# EAGLE design dc5032018banglet (EAGLE 8.6.3)
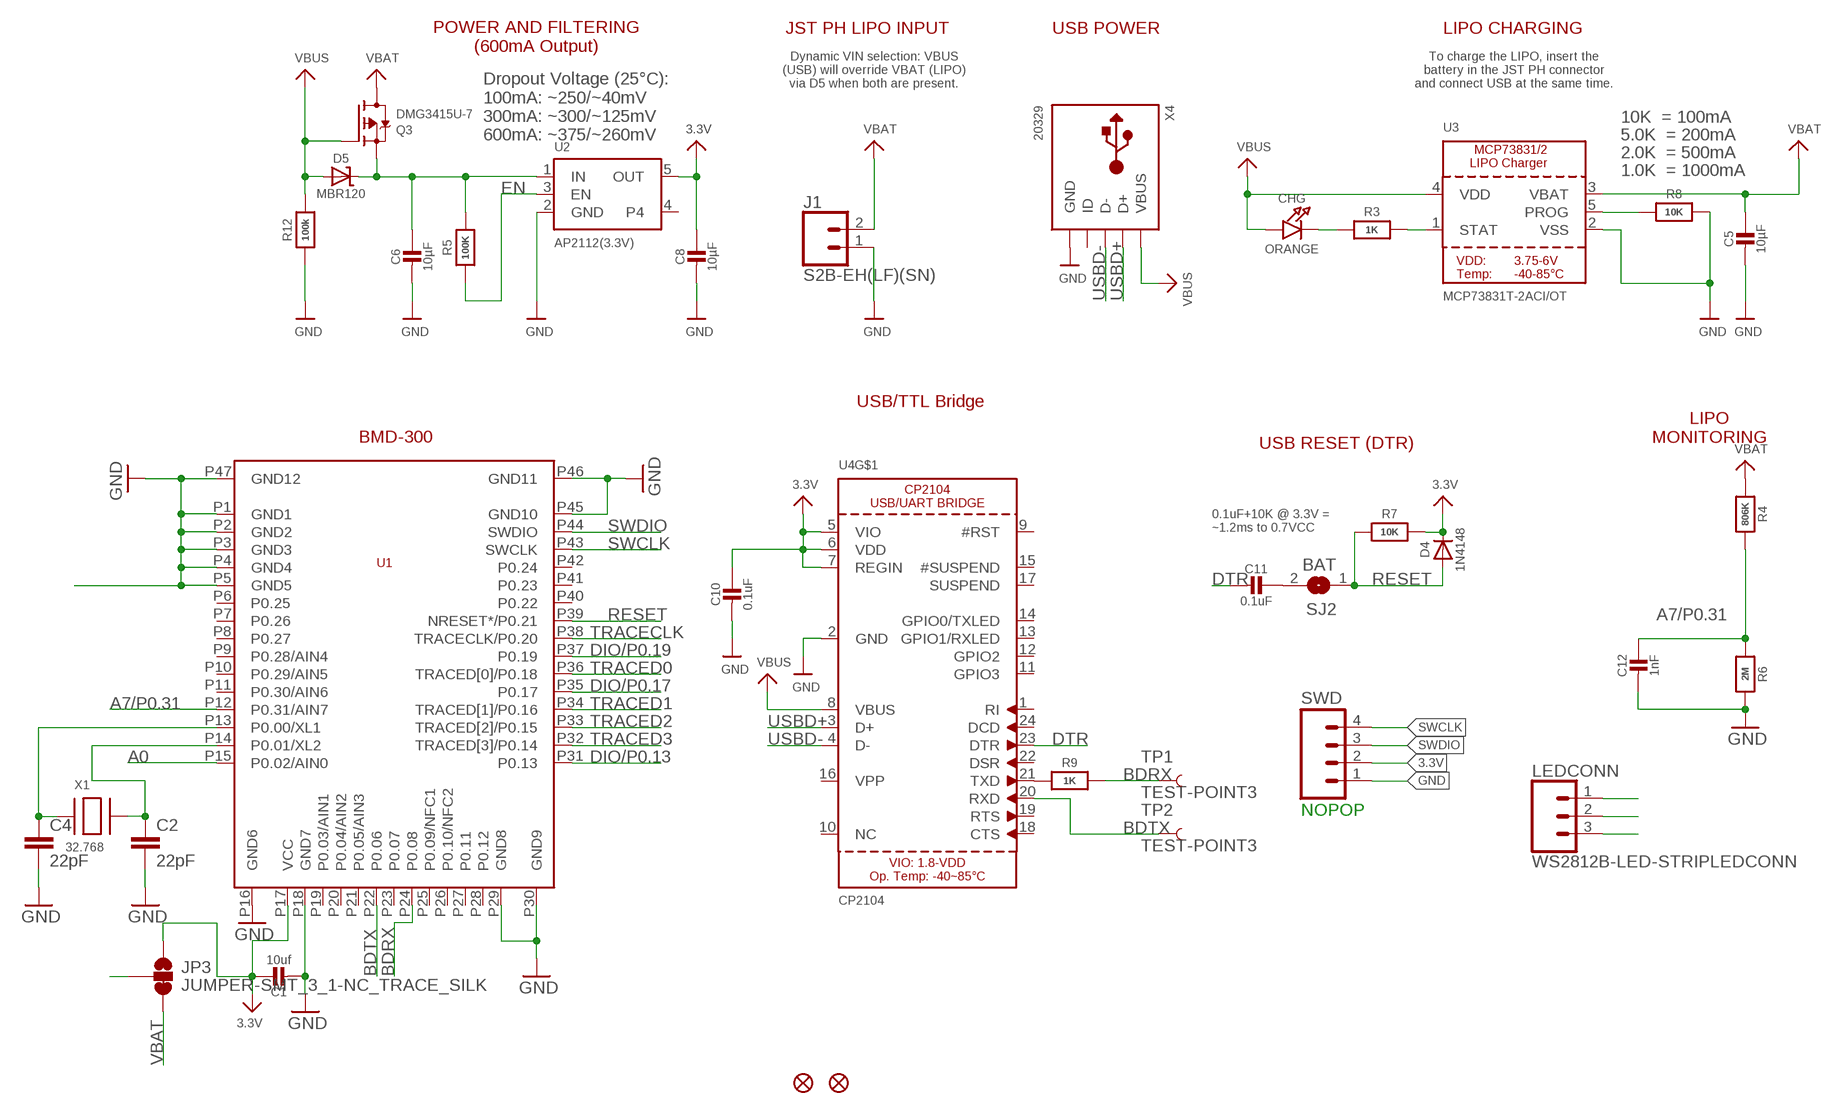
[diagram p0: schematic, sheet 1]

## Parts
C1  10uf  CAP_CERAMIC0805-NOOUTLINE  [0805-NO]
C2  22pF  22PF-0603-50V-5%  [0603]
C4  22pF  22PF-0603-50V-5%  [0603]
C5  10µF  CAP_CERAMIC0805-NOOUTLINE  [0805-NO]
C6  10µF  CAP_CERAMIC0805-NOOUTLINE  [0805-NO]
C8  10µF  CAP_CERAMIC0805-NOOUTLINE  [0805-NO]
C10  0.1uF  CAP_CERAMIC0603_NO  [0603-NO]
C11  0.1uF  CAP_CERAMIC0603_NO  [0603-NO]
C12  1nF  CAP_CERAMIC0603_NO  [0603-NO]
CHG  ORANGE  LED0805_NOOUTLINE  [CHIPLED_0805_NOOUTLINE]
D4  1N4148  DIODESOD-323  [SOD-323]
D5  MBR120  DIODE-SCHOTTKYSOD-123  [SOD-123]
FD1  FIDUCIALUFIDUCIAL  [FIDUCIAL-MICRO]
FD2  FIDUCIALUFIDUCIAL  [FIDUCIAL-MICRO]
J1  S2B-EH(LF)(SN)  [1X2(2.5)]
JP3  JUMPER-SMT_3_1-NC_TRACE_SILK  [SMT-JUMPER_3_1-NC_TRACE_SILK]
LEDCONN  WS2812B-LED-STRIPLEDCONN  [1X3(2.5)]
Q3  DMG3415U-7  MOSFET-P  [SOT23-R]
R3  1K  RESISTOR_0603_NOOUT  [0603-NO]
R4  806K  RESISTOR_0603_NOOUT  [0603-NO]
R5  100K  RESISTOR_0603_NOOUT  [0603-NO]
R6  2M  RESISTOR_0603_NOOUT  [0603-NO]
R7  10K  RESISTOR_0603_NOOUT  [0603-NO]
R8  10K  RESISTOR_0603_NOOUT  [0603-NO]
R9  1K  RESISTOR_0603_NOOUT  [0603-NO]
R12  100k  RESISTOR_0603_NOOUT  [0603-NO]
SJ2  BAT  SOLDERJUMPERCLOSED  [SOLDERJUMPER_CLOSEDWIRE]
SWD  M04LOCK  [1X04_LOCK@1]
TP1  TEST-POINT3  [PAD.03X.03]
TP2  TEST-POINT3  [PAD.03X.03]
U1  BMD-300  [BMD-300]
U2  AP2112(3.3V)  VREG_SOT23-5  [SOT23-5]
U3  MCP73831T-2ACI/OT  MCP73831/2  [SOT23-5]
U4  CP2104  [QFN24_4MM_SMSC]
X1  32.768  XTAL-3.2X1.5  [XTAL3215]
X4  20329  MICRO-USB-SMD-B-(10118193-0001LF)-ADASYM  [MICRO-USB5+6P-SMD-0.65-B]

## Nets
3.3V [power]: C1.1 C8.1 C10.1 D4.C JP3.1 R7.2 SWD.2 U1.P17(VCC) U2.5(OUT) U4.5(VIO) U4.6(VDD) U4.7(REGIN)
A0: LEDCONN.2 U1.P15(P0.02/AIN0)
A7/P0.31: C12.1 R4.2 R6.1 U1.P12(P0.31/AIN7)
BDRX: R9.2 TP1.P$1 U1.P24(P0.08)
BDTX: TP2.P$1 U1.P22(P0.06) U4.20(RXD)
DIO/P0.13: U1.P31(P0.13)
DIO/P0.17: U1.P35(P0.17)
DIO/P0.19: U1.P37(P0.19)
DTR: C11.2 U4.23(DTR)
EN: R5.1 U2.3(EN)
GND: C1.2 C2.2 C4.2 C5.2 C6.2 C8.2 C10.2 C12.2 J1.1 LEDCONN.3 R6.2 R8.2 R12.1 SWD.1 U1.P1(GND1) U1.P2(GND2) U1.P3(GND3) U1.P4(GND4) U1.P5(GND5) U1.P16(GND6) U1.P18(GND7) U1.P29(GND8) U1.P30(GND9) U1.P45(GND10) U1.P46(GND11) U1.P47(GND12) U2.2(GND) U3.2(VSS) U4.2(GND) X4.5(GND) X4.S1(GND) X4.S2(GND) X4.S3(GND) X4.S4(GND) X4.S5(GND) X4.S6(GND)
N$1: C2.1 U1.P14(P0.01/XL2) X1.P$2
N$2: C4.1 U1.P13(P0.00/XL1) X1.P$1
N$4: CHG.C R3.1
N$9: R3.2 U3.1(STAT)
N$10: R8.1 U3.5(PROG)
N$11: R9.1 U4.21(TXD)
N$13: C11.1 SJ2.2
RESET: D4.A R7.1 SJ2.1 U1.P39(NRESET*/P0.21)
SWCLK: SWD.4 U1.P43(SWCLK)
SWDIO: SWD.3 U1.P44(SWDIO)
TRACECLK: U1.P38(TRACECLK/P0.20)
TRACED0: U1.P36(TRACED[0]/P0.18)
TRACED1: U1.P34(TRACED[1]/P0.16)
TRACED2: U1.P33(TRACED[2]/P0.15)
TRACED3: U1.P32(TRACED[3]/P0.14)
USBD+: U4.3(D+) X4.3(D+)
USBD-: U4.4(D-) X4.2(D-)
VBAT [power]: C5.1 J1.2 JP3.3 Q3.3(D) R4.1 U3.3(VBAT)
VBUS [power]: CHG.A D5.A Q3.1(G) R12.2 U3.4(VDD) U4.8(VBUS) X4.1(VBUS)
VIN [power]: C6.1 D5.C Q3.2(S) R5.2 U2.1(IN)
VLED: JP3.2 LEDCONN.1
Unconnected: U1.P6(P0.25) U1.P7(P0.26) U1.P8(P0.27) U1.P9(P0.28/AIN4) U1.P10(P0.29/AIN5) U1.P11(P0.30/AIN6) U1.P19(P0.03/AIN1) U1.P20(P0.04/AIN2) U1.P21(P0.05/AIN3) U1.P23(P0.07) U1.P25(P0.09/NFC1) U1.P26(P0.10/NFC2) U1.P27(P0.11) U1.P28(P0.12) U1.P40(P0.22) U1.P41(P0.23) U1.P42(P0.24) U2.4 U4.1(RI) U4.9(#RST) U4.10(NC) U4.11(GPIO3) U4.12(GPIO2) U4.13(GPIO1/RXLED) U4.14(GPIO0/TXLED) U4.15(#SUSPEND) U4.16(VPP) U4.17(SUSPEND) U4.18(CTS) U4.19(RTS) U4.22(DSR) U4.24(DCD) X4.4(ID)

## Notes on the sheet
- JST PH LIPO INPUT | USB POWER | LIPO CHARGING
- POWER AND FILTERING
  (600mA Output)
- Dynamic VIN selection: VBUS
  (USB) will override VBAT (LIPO)
  via D5 when both are present.
- To charge the LIPO, insert the
  battery in the JST PH connector
  and connect USB at the same time.
- 10K  = 100mA
- Dropout Voltage (25°C):
  100mA: ~250/~40mV
  300mA: ~300/~125mV
  600mA: ~375/~260mV
- 5.0K  = 200mA
- 2.0K  = 500mA
- 1.0K  = 1000mA
- USB/TTL Bridge
- BMD-300 | USB RESET (DTR)
- LIPO
  MONITORING
- 0.1uF+10K @ 3.3V =
  ~1.2ms to 0.7VCC
- NOPOP

## Power pins joined to a net without a drawn wire
TP: U4.THERM(TP)

## Library data of the parts
C1 C5 C6 C8 C10-C12 = microbuilder:CAP_CERAMIC: Ceramic Capacitors For new designs, use the packages preceded by an '_' character since they are more reliable: The following footprints should be used on most boards: _0402 - Standard footprint for regular board layouts _0603 - Standard footprint for regular board layouts _0805 - Standard footprint for regular board layouts _1206 - Standard footprint for regular board layouts For extremely tight-pitch boards where space is at a premium, the following 'micro-pitch' footprints can be used (smaller pads, no silkscreen outline, etc.): _0402MP - Micro-pitch footprint for very dense/compact boards _0603MP - Micro-pitch footprint for very dense/compact boards _0805MP - Micro-pitch footprint for very dense/compact boards _1206MP - Micro-pitch footprint for very dense/compact boards
C2 C4 = SparkFun-Capacitors:22PF: 22pF ceramic capacitors A capacitor is a passive two-terminal electrical component used to store electrical energy temporarily in an electric field.; PROD_ID: CAP-07876
CHG = microbuilder:LED: LED 0603 - 0603 Surface Mount Package 2mA: Green LED - Low Power (3.9mcd, 2ma, 1.7Vf) - Digikey: 475-2709-2-ND Orange LED - Low Power (9.8mcd, 2ma, 1.8Vf) - Digikey: 475-1194-2-ND Red LED - Low Power (5mcd, 2ma, 1.8Vf) - Digikey: 475-1195-2-ND Yellow LED - Low Power (7mcd, 2ma, 1.8Vf) - Digikey: 475-1196-2-ND 5mA: Blue LED - Low Power (17mcd, 5ma, 2.9Vf) - Digikey: LNJ937W8CRACT-ND 0805 - 0805 Surface Mount Package 2mA: Red LED (8.8mcd, 2mA, 1.8Vf, Clear) - Low Power [Digikey: 475-2510-1-ND] Green LED (5mcd, 2mA, 1.8Vf, Clear) - Low Power [Digikey: 475-2730-1-ND] Yellow LED (11.3mcd, 2mA, 1.8Vf, Clear) - Low Power [Digikey: 475-2555-1-ND] 20mA: Red LED (104mcd, 20mA, Diffused) - LS R976 [Digikey: 475-1278-6-ND] Red LED (12mcd, 20mA, 2.0Vf, Clear) - APT2012EC [Digikey: 754-1128-1-ND] Green LED (15mcd, 20mA, 2.2Vf, Clear) - APT2012GC [Digikey: 754-1131-1-ND] Orange LED (160mcd, 20mA, 2.1Vf, Clear) - APT2012SECK [Digikey: 754-1130-1-ND] 1206 - 1206 Surface Mount Package Green LED (26mcd, 20mA, Diffused) - LG N971 [Digikey: 475-1407-6-ND] Red LED (15mcd, 20mA, Diffused) - LH N974 [Digikey: 475-1416-6-ND] Cree - Cree High-Power Surface Mount LEDs XPEBWT-L1-0000-00D50 - White 111lm 350mA 2.9Vf 6200K 110° XTEAWT-00-0000-00000LEE3 - White 114lm 350mA 2.85Vf 5000K 115° Everlight - Everlight 45-21 Series Surface Mount LEDs 45-21/QK2C-B2832AC2CB2/2T - Warm White 2000mcd 20mA 3.25Vf 3050K 120° 45-21/LK2C-B38452C4CB2/2T - Nuetral White 2000mcd 20mA 3.25Vf 4150K 120° 45-21/LK2C-B50634C6CB2/2T - Cold White 2200mcd 20mA 3.25Vf 5650K 120° PLCC2 Reverse Mount LS T77K-J1L2-1-0-2-R18-Z - Red 11.25mcd 2mA 1.8Vf 630nm 120° LO T77K-L1M2-24-Z - Orange 19.6mcd 2mA 1.8Vf 606nm 120° LY T77K-K2M1-26-Z - Yellow 15.7mcd 2mA 1.8Vf 587nm 120°
D4 = microbuilder:DIODE: Diode SMA Model Volts Amps Type Vf Ir Digikey # Notes SSA34-E3 40V 3A Schottky 480mV @ 3A 200uA @ 40V SSA34-E3/61TGITR-ND CDBA120-G 20V 1A Schottky 500mV @ 1A 500uA @ 20V 641-1014-6-ND REEL MBRA210 10V 2A Schottky 350mV @ 2A 700uA @ 10V MBRA210LT3 SOD-123 Model Volts Amps Type Vf Ir Order # Notes BAT54T1G 30V 200mA Schottky 800mV @ 200mA 2uA @ 25V BAT54T1GOSTR-ND B0530W 30V 500mA Schottky 430mV @ 500mA 130uA @ 30V B0530W-FDICT-ND REEL MBR120 20V 1A Schottky 340mV @ 1A MBR120VLSFT1GOSCT-ND SOD-323 Model Volts Amps Type Vf Ir Order # Notes PMEG2005EJ 20V 500mA Schottky 355mV @ 500mA 568-4110-1-ND ZLLS410 10V 570mA Schottky 380mV @ 570mA ZLLS410CT-ND 1N4148WS 75V 150mA Silicon/Simple 1V 1N4148WSFSCT-ND REEL SOD-523 Model Volts Amps Type Vf Ir Order # Notes BAT54XV2 30V 200mA Schottky 0.8V @ 100mA BAT54XV2CT-ND TB751S 30V 30mA Schottky RB751S-40TE61CT-ND SOT23-R/W (R = Solder Paste/Reflow Ovens, W = Hand-Soldering) Model Volts Amps Type Vf Ir Order # Notes BAT54FILM 40V 300mA Schottky 497-7162-1-ND POWERDI-5 Model Volts Amps Type Vf Ir Order # Notes PDS560 60V 5A Schottky 670mV @ 5A 150uA @ 60V PDS560DICT-ND
D5 = microbuilder:DIODE-SCHOTTKY
FD1 FD2 = SparkFun-Aesthetics:FIDUCIAL: Fiducial Alignment Points Point-of-reference for pick-and-place machines and other optical instruments.
J1 = banglet:S2B-EH(LF)(SN): 455-1625-ND
JP3 = SparkFun-Jumpers:JUMPER-SMT_3_1-NC_TRACE: Normally closed trace jumper (1 of 2 connections) This jumper has a trace between two pads so it's normally closed (NC). The other connection is normally open (NO). Use a razor knife to open the connection. For best results follow the IPC guidelines for cutting traces: Cutout at least 0.063 mm (0.005 in). Remove all loose material to clean up the cut area. Seal the cut with an approved epoxy. Reapply solder to reclose the connection, or to close the NO connection.
LEDCONN = banglet:WS2812B-LED-STRIP: 16.4ft WS2812B LED strip light via holes
Q3 = microbuilder:MOSFET-P: P-Channel Mosfet LEGEND VDS: Voltage Drain-Source ID: Drain Current RDS(ON): Drain-Source On-State Resistance VGS(TH): Gate-Source Threshold Voltage CISS: Drain-Source Input Capacitance SOT-23 Name VDS ID RDS(ON) VGS(TH) CISS Order Number IRLML5103 30V 760mA 600 mOhm -- 75pF @ 25V Digikey: IRLML5103PBFCT-ND IRLML6401 12V 4.3A 50 mOhm 950mV @ 250µA 830pF @ 10V Digikey: IRLML6401PBFTR-ND NTR0202PL 20V 400mA 800 mOhm 2.3V @ 250uA 70pF @ 5V Digikey: NTR0202PLT1GOSTR-ND NTR4101PT1G 20V 1.8A 85 mOhm 1.2V @ 250uA 675pF @ 10V Digikey: NTR4101PT1GOSCT-ND DMP2004K 20V 600mA 900 mOhm 1V @ 250uA 175pF @ 16V Digikey: DMP2004KDICT-ND PMV65XP 20V 3.9A 76 mOhm 950mV @ 1mA 725pF @ 20V Digikey: 568-2358-2-ND TO-252 Name VDS ID RDS(ON) VGS(TH) CISS Order Number AOD417 30V 25A 34 mOhm 3V @ 250µA 920pF @ 15V Digikey: 785-1106-2-ND
R3-R9 R12 = microbuilder:RESISTOR: Resistors For new designs, use the packages preceded by an '_' character since they are more reliable: The following footprints should be used on most boards: _0402 - Standard footprint for regular board layouts _0603 - Standard footprint for regular board layouts _0805 - Standard footprint for regular board layouts _1206 - Standard footprint for regular board layouts For extremely tight-pitch boards where space is at a premium, the following 'micro-pitch' footprints can be used (smaller pads, no silkscreen outline, etc.): _0402MP - Micro-pitch footprint for very dense/compact boards _0603MP - Micro-pitch footprint for very dense/compact boards _0805MP - Micro-pitch footprint for very dense/compact boards _1206MP - Micro-pitch footprint for very dense/compact boards
SJ2 = microbuilder:SOLDERJUMPER: SMD Solder JUMPER Solder the two pads together to create a connection, or remove the solder to break it. REFLOW - Use this footprint for solder paste and reflow ovens. WAVE - Use this footprint for hand-soldering (larger pads). CLOSED - Has a trace between the two pads to ensure it is closed by default. The trace needs to be cut to disable the jumper, and can be closed again by creating a solder bridge between the two pads.
SWD = SparkFun-Connectors:M04: Header 4 Standard 4-pin 0.1" header. Use with straight break away headers (SKU : PRT-00116), right angle break away headers (PRT-00553), swiss pins (PRT-00743), machine pins (PRT-00117), and female headers (PRT-00115). Molex polarized connector foot print use with SKU : PRT-08231 with associated crimp pins and housings. 1MM SMD Version SKU: PRT-10208
TP1 TP2 = SparkFun-Connectors:TEST-POINT: SparkFun Test Points Bare copper test points for troubleshooting or In-Circuit-Testing. These are used by our Production team for verifying production board runs using pogo-pins on test beds. SparkFun Products: SparkFun LSM9DS1 Breakout <https://www.sparkfun.com/products/13284> SparkFun PSOC <https://www.sparkfun.com/products/13714> SparkFun Load Cell Amplifier <https://www.sparkfun.com/products/13879>
U1 = BMD-300:BMD-300
U2 = microbuilder:VREG_SOT23-5: SOT23-5 Fixed Voltage Regulators Part Current Out V Out V In V Dropout θJA (°C/W) TJ (°C) Digikey Part No. ADP121 150mA 3.3V 3.4-5.5V 0.09V @ 150mA -- -- ADP121-AUJZ33R7CT-ND ADP121 150mA 3.0V 3.1-5.5V 0.09V @ 150mA -- -- ADP121-AUJZ30R7CT-ND ADP122 300mA 3.3V 3.4-5.5V 0.085V @ 300mA -- -- ADP122AUJZ-3.3-R7CT-ND ADP1712 300mA 3.3V 3.5-5.5V 0.17V @ 300mA -- -- ADP1712AUJZ-3.3-R7TR-ND AP7311 (Low Cost) 150mA 3.3V 3.5-6V 0.15V @ 150mA -- -- AP7311-33WG-7DICT-ND LD39015M18R 150mA 1.8V 1.9V-5.5V 0.08V @ 100mA -- -- 497-6977-1-ND LP2985A-33DBVR 150mA 3.3V 3.3-16V 0.28V @ 150mA 206 150 296-18479-1-ND MCP1824T-3302E/OT 300mA 3.3V 3.5V-6V 0.2V @ 300mA -- -- MCP1824T-3302E/OTCT-ND MIC5205-2.5YM5 TR 150mA 2.5V 2.7-16V 0.165V @ 150mA -- -- 576-1257-2-ND MIC5205-3.0YM5 TR 150mA 3.0V 3.2V-16V 0.165V @ 150mA -- -- 576-1258-2-ND MIC5205-3.3YM5 TR 150mA 3.3V 3.5V-16V 0.165V @ 150mA -- -- 576-1259-2-ND TPS780330220 150mA 3.3V+2.2V 3.6-5.5V 250mV Max -- -- 296-23332-1-ND TDA3663/N1,135 100mA 3.3V 3.5-45V 0.18V @ 50mA -- -- 568-5343-1-ND Max operating temp can be calculated using θJA, TJ (max junction temperature), and power in watts. Set the "Maximum Ambient Temperature" until it reaches TJ ("Max Junction Temperature"), which is the absolute limit for safe use of the regulator: Heat Sink Temperature Calculator <http://www.daycounter.com/Calculators/Heat-Sink-Temperature-Calculator.phtml> For example, With 12V source into a 3.3V LP2985 and a 30mA load, we are dissipating (12V-3.3V) * 0.03A = 0.261W. With a θJA of 206 °C/W, a TJ of 150°C, and 261mW we can safely use the chip without a heat sink up to 75°C (=147.1°C Junction Temperature).
U3 = microbuilder:MCP73831/2: MCP73831/2 LIPO Charger VDD: 3.75 - 6V Temp -40 - 85°C Programmable Charge Rate: 15-500mA NOTE: STAT is a tri-state logic output on the MCP73831 and an open-drain output on the MCP73832. SOT23-5 with 4.2V output and tri-state logic on STAT = MCP73831T-2ACI/OT
U4 = microbuilder:CP2104: CP2104 - USB to UART Bridge VDD Output: 3.45V
X1 = adafruit2:XTAL: Low cost SMT crystals, no capacitors included http://www.ladyada.net/library/eagle
X4 = microbuilder:MICRO-USB-SMD-B-(10118193-0001LF)-ADASYM

## Net classes
1 power: width 0.254 mm

## Board
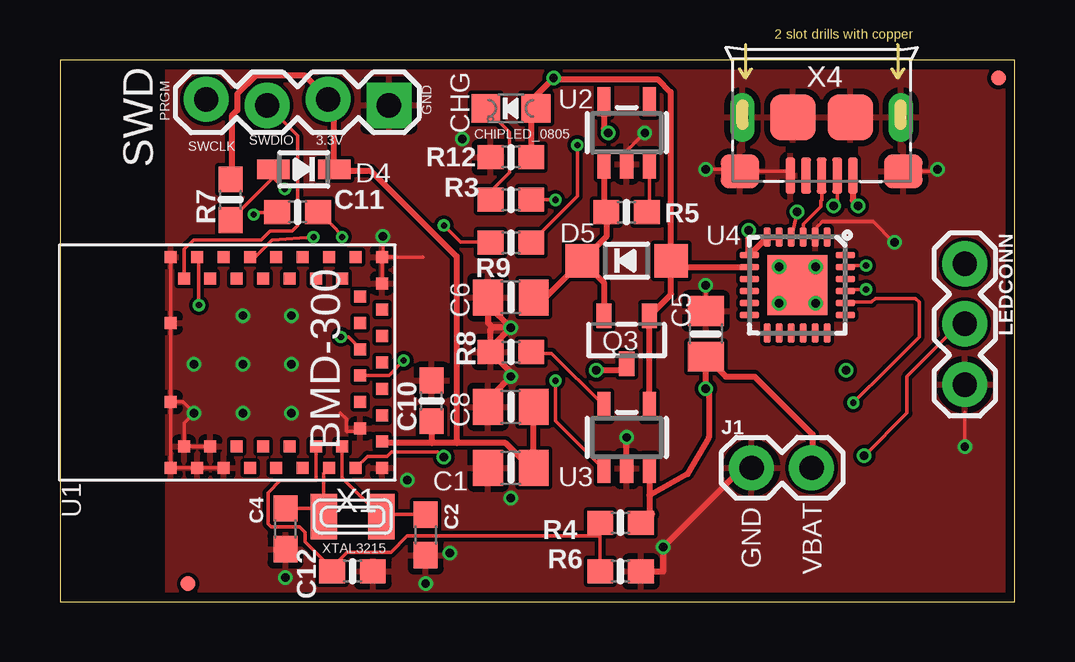
[diagram p1: board, top side]
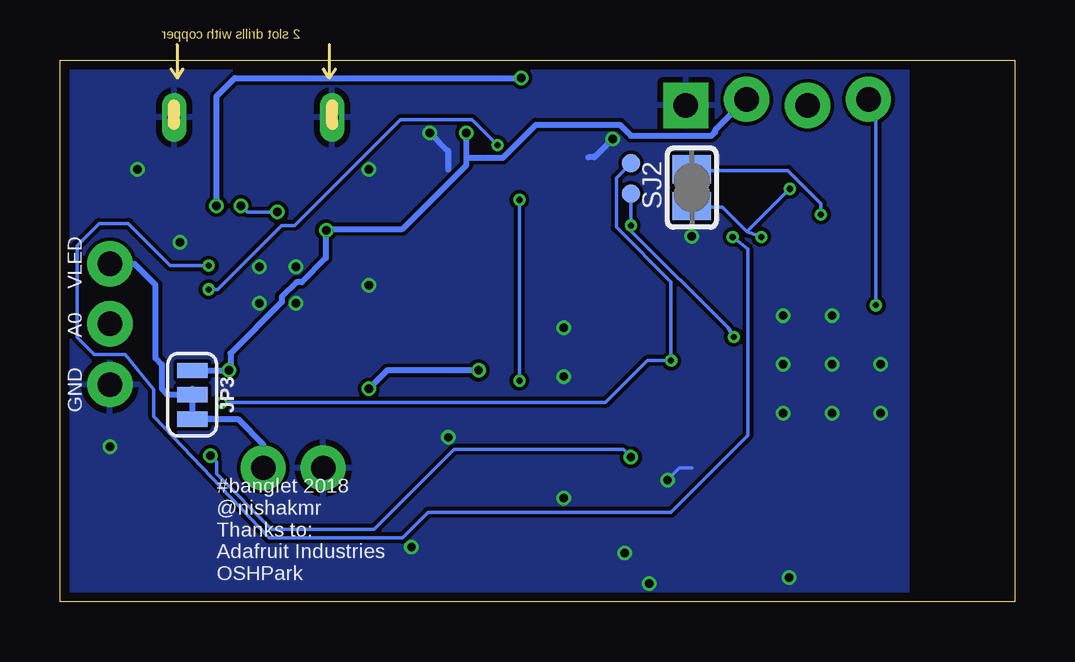
[diagram p2: board, bottom side, seen from below]

Size 39.8 x 22.6 mm. Coordinates in mm from the lower left corner, seen from the top.
Outline: 0,0 39.8,0 39.8,22.6 0,22.6 0,0
Copper layers (1*16): Top 0.035559375mm / dielectric 1.6mm / Bottom 0.035559375mm
Design rules "oshpark-2layer *": minimum track width 6mil, minimum drill 10mil, track to track 6mil, track to pad 6mil, pad to pad 6mil, via to via 6mil, smd to smd 6mil, copper to edge 15mil, drill to drill 6mil, minimum pad ring 5mil, minimum via ring 5mil, stop-mask expansion 2.5mil, vias tented up to drill 25mil, thermal gap 10mil

### Footprints (pad centres in the part's own frame; a part is rotated, then mirrored left to right if it is on the bottom)
0805-NO = smd 1.24 x 1.5: 1 -0.95,0; 2 0.95,0
0603 = smd 1.1 x 1: 1 -0.85,0; 2 0.85,0
0603-NO = smd 1.075 x 1: 1 -0.85,0; 2 0.85,0
CHIPLED_0805_NOOUTLINE = smd 1.2 x 1.2: A 0,-1.05; C 0,1.05
SOD-323 = smd 1.35 x 0.8: A 1.27,0; C -1.27,0
SOD-123 = smd 1.4 x 1.4: A 1.85,0; C -1.85,0
FIDUCIAL-MICRO = smd 0.635 x 0.635: 1 0,0
1X2(2.5) = drill 1.016 pad 1.88: 1 0,0; 2 2.5,0
SMT-JUMPER_3_1-NC_TRACE_SILK = smd 0.635 x 1.27: 1 -1.016,0; 2 0,0; 3 1.016,0
1X3(2.5) = drill 1.016 pad 1.88: 1 0,0; 2 2.5,0; 3 5.04,0
SOT23-R = smd 0.635 x 1.016: 1 -0.95,-1; 2 0.95,-1; 3 0,1
SOLDERJUMPER_CLOSEDWIRE = smd 1.168 x 1.6: 1 -0.762,0; 2 0.762,0 | smd 0.635 x 0.203: WIRE 0,0
1X04_LOCK@1 = drill 1.016 pad 1.88 square: 1 0,0.127 | drill 1.016 pad 1.88: 2 2.54,-0.127; 3 5.08,0.127; 4 7.62,-0.127
PAD.03X.03 = smd 0.762 x 0.762: P$1 0,0
BMD-300 = smd 0.5 x 0.5: P1 0.5,9.35; P2 1.4,8.8; P3 0.5,8.25; P4 1.4,7.7; P5 0.5,7.15; P6 1.4,6.6; P7 0.5,6.05; P8 1.4,5.5; P9 0.5,4.95; P10 1.4,4.4; P11 0.5,3.85; P12 1.4,3.3; P13 0.5,2.75; P14 1.4,2.2; P15 0.5,1.65; P16 0.5,0.55; P17 1.6,0.55; P18 2.15,1.45; P19 2.7,0.55; P20 3.25,1.45; P21 3.8,0.55; P22 4.35,1.45; P23 4.9,0.55; P24 5.45,1.45; P25 6,0.55; P26 6.55,1.45; P27 7.1,0.55; P28 7.65,1.45; P29 8.2,0.55; P30 9.3,0.55; P31 9.3,1.65; P32 8.4,2.2; P33 9.3,2.75; P34 8.4,3.3; P35 9.3,3.85; P36 8.4,4.4; P37 9.3,4.95; P38 8.4,5.5; P39 9.3,6.05; P40 8.4,6.6; P41 9.3,7.15; P42 8.4,7.7; P43 9.3,8.25; P44 8.4,8.8; P45 9.3,9.35; P46 6.55,9.35; P47 3.25,9.35
SOT23-5 = smd 0.55 x 1.2: 1 -0.95,-1.3; 2 0,-1.3; 3 0.95,-1.3; 4 0.95,1.3; 5 -0.95,1.3
QFN24_4MM_SMSC = smd 0.8 x 0.28: 1 -2,1.25; 2 -2,0.75; 3 -2,0.25; 4 -2,-0.25; 5 -2,-0.75; 6 -2,-1.25; 13 2,-1.25; 14 2,-0.75; 15 2,-0.25; 16 2,0.25; 17 2,0.75; 18 2,1.25 | smd 0.28 x 0.8: 7 -1.25,-2; 8 -0.75,-2; 9 -0.25,-2; 10 0.25,-2; 11 0.75,-2; 12 1.25,-2; 19 1.25,2; 20 0.75,2; 21 0.25,2; 22 -0.25,2; 23 -0.75,2; 24 -1.25,2 | smd 2.5 x 2.5: THERM 0,0
XTAL3215 = smd 1.1 x 1.9: P$1 1.2,0; P$2 -1.2,0
MICRO-USB5+6P-SMD-0.65-B = smd 0.4 x 1.5: 1 -1.3,-0.25; 2 -0.65,-0.25; 3 0,-0.25; 4 0.65,-0.25; 5 1.3,-0.25 | smd 1.6 x 1.4: S1 -3.4,-0.427; S6 3.4,-0.427 | drill 0.508 pad 1.016 long: S2 -3.3,-2.675; S5 3.3,-2.675 | smd 1.9 x 1.9: S3 -1.2,-2.675; S4 1.2,-2.675

### Placement (x,y rotation side)
C1  18.8,5.59 180 top
C2  15.24,2.79 270 top
C4  9.4,3.05 270 top
C5  26.92,11.18 90 top
C6  18.8,12.7 180 top
C8  18.8,8.13 180 top
C10  15.49,8.38 90 top
C11  9.91,16.26 0 top
C12  12.19,1.27 0 top
CHG  18.8,20.57 90 top
D4  10.16,18.03 180 top
D5  23.62,14.22 0 top
FD1  5.33,0.76 0 top
FD2  39.12,21.84 0 top
J1  28.83,5.59 0 top
JP3  34.29,8.64 270 bottom
LEDCONN  37.72,14.1 270 top
Q3  23.62,10.92 180 top
R3  18.8,16.76 0 top
R4  23.37,3.3 180 top
R5  23.62,16.26 180 top
R6  23.37,1.27 0 top
R7  7.11,16.76 90 top
R8  18.8,10.41 180 top
R9  18.8,14.99 180 top
R12  18.8,18.54 0 top
SJ2  13.46,17.27 90 bottom
SWD  13.72,20.83 180 top
TP1  16,17.02 0 bottom
TP2  16,18.29 0 bottom
U1  13.97,5.08 90 top
U2  23.62,19.56 0 top
U3  23.62,6.86 0 top
U4  30.73,13.21 270 top
X1  12.19,3.56 180 top
X4  31.75,17.53 180 top

### Tracks (layer width: path | path; a pad name or v marks a point on that pad's centre or on a via)
3.3V  (via drill 0.35)
  Top 0.254: U2.5 22.67,19.75 v22.86,19.56 | U4.5 U4.6 U4.7 28.7,14.49 v28.7,15.49 | C8.1 C1.1 19.61,5.59 18.58,6.62 16.54,6.62 | U1.P17 13.48,6.62 15.49,6.62 | 16.54,6.62 15.49,6.62 | R7.2 7.16,17.68 7.16,20.27 7.39,20.5 7.39,21.18 8.15,21.95 10.21,21.95 11.12,21.03 SWD.2 11.43,20.7 D4.C 11.51,17.98 12.95,17.98 16.54,14.4 16.54,6.62 | C10.1 15.49,6.62
  Bottom 0.254: JP3.1 v32.77,9.65 32.69,9.75 32.69,10.36 30.56,12.5 30.56,12.72 29.95,13.33 29.72,13.33 28.73,14.33 28.73,15.39 v28.7,15.49 28.65,15.54 25.53,15.54 22.86,18.21 22.86,18.52 | 22.86,18.52 v22.86,19.56 | 22.86,18.52 21.34,18.52 19.96,19.89 16.46,19.89 16,19.43 12.65,19.43 12.5,19.58 12.5,19.66 11.2,20.96 SWD.2
A0  (via drill 0.35)
  Top 0.152: 12.47,5.73 U1.P15 12.81,6.07 13.64,6.07 13.82,6.26 15.75,6.26 15.97,6.04 v16,6.04 | v33.53,6.1 35.31,7.87 35.31,9.4 37.51,11.6 LEDCONN.2
  Bottom 0.152: v16,6.04 16.32,6.35 23.38,6.35 26.7,3.03 30.97,3.03 33.27,5.33 33.27,5.84 v33.53,6.1
A7/P0.31
  Top 0.152: R4.2 22.52,2.74 | 22.52,2.74 R6.1 | U1.P12 10.67,5.06 9.18,5.06 8.67,4.54 8.67,3.25 8.8,3.12 9.99,3.12 10.21,2.9 10.21,2.51 11.34,1.38 C12.1 11.35,1.45 11.96,2.06 13.79,2.06 14.48,2.74 22.52,2.74
BDRX  (via drill 0.25)
  Top 0.152: v11.71,11.05 12.04,11.05 12.5,10.59 U1.P24 | v16,15.7 16.69,15.01 17.91,15.01 R9.2
  Bottom 0.152: v11.71,11.05 11.96,11.43 16,15.47 v16,15.7 TP1.P$1
BDTX  (via drill 0.25)
  Top 0.152: v14.33,10.06 13.72,9.45 12.57,9.45 U1.P22 | v33.07,8.31 34.48,9.72 35.81,11.05 35.81,12.5 35.66,12.65 33.98,12.65 33.83,12.5 32.77,12.5 U4.20
  Bottom 0.152: TP2.P$1 16.61,17.68 16.61,15.62 14.33,13.33 v14.33,10.06 15.32,10.06 17.07,8.31 v33.07,8.31
DTR  (via drill 0.25)
  Top 0.152: v33.6,14.02 32.77,14.02 U4.23 | v11.76,15.21 11.51,15.54 10.82,16.23 C11.2
  Bottom 0.152: v33.6,14.02 35.2,14.02 36.96,15.77 38.18,15.77 39.09,14.86 39.09,11.02 38.38,10.31 37.08,10.31 35.89,8.86 35.89,7.72 31.09,2.67 25.53,2.67 24.46,3.73 14.33,3.73 11.12,6.93 11.12,14.71 v11.76,15.21
EN
  Top 0.152: U2.3 24.57,16.36 R5.1
GND  (via drill 0.35)
  Top 0.152: U1.P18 12.4,7.11 11.94,7.11 11.94,7.62 11.68,7.87 | U1.P47 5.13,8.33 v5.59,7.87 5.17,7.46 U1.P2 U1.P4 | U1.P5 U1.P3 U1.P1 U1.P47 | U1.P47 U1.P46 U1.P45 | U1.P29 U1.P30 | U2.2 23.62,18.8 v24.38,19.56 | X4.5 30.27,17.95 X4.S6 28.27,18.03 v26.92,18.03 | X4.S1 36.49,17.95 v36.58,18.03 | C5.2 v26.92,13.21 | 15.14,14.38 U1.P30 | v13.46,15.24 13.46,14.42 U1.P30 | U4.2 31.55,15.24 31.55,15.62 31.77,15.85 33.91,15.85 34.75,15.01 v34.8,14.99 | v37.72,6.48 37.72,7.89
  Top 0.254: 18.03,11.43 17.85,11.62 C6.2 17.85,12.38 v18.8,11.43 | v18.8,11.43 18.03,11.43 | R8.2 17.95,11.34 18.03,11.43 | U3.2 v23.62,6.86 | R6.2 25.15,1.27 v25.15,2.29 28.45,5.59 | C1.2 17.85,5.27 | C8.2 17.85,8.45 v18.8,9.4 18.8,9.56 R8.2 | R8.2 17.95,10.58 v18.8,11.43
  Bottom 0.152: v14.48,5.08 13.97,5.59 13.46,5.59
  Bottom 0.254: v24.38,19.56 23.62,18.8 23.62,18.03 | v16.76,19.3 17.53,18.54 17.78,18.54
  other vias: 7.62,11.94 9.65,11.94 9.65,9.91 7.62,9.91 5.59,9.91 7.62,7.87 9.65,7.87 18.8,4.32 16.26,2.03 9.4,1.02 15.24,0.76 29.97,13.97 31.5,13.97 31.5,12.45 29.97,12.45
  pour Top: 0,22.61 39.88,22.61 39.88,0 0,0
  pour Bottom: 0,22.61 39.88,22.61 39.88,0 0,0
N$1
  Top 0.152: U1.P14 11.77,5.18 X1.P$2 13.48,3.64 C2.1
N$2
  Top 0.152: U1.P13 10.99,5.35 X1.P$1 10.65,3.9 C4.1
N$4
  Top 0.152: R3.1 17.98,16.76 17.98,17.14 18.75,17.91 18.75,19.58 CHG.C
N$9  (via drill 0.25)
  Top 0.152: v20.65,16.76 R3.2 | v20.65,9.22 20.65,7.54 22.63,5.56 U3.1
  Bottom 0.152: v20.65,9.22 v20.65,16.76
N$10
  Top 0.152: R8.1 19.66,10.36 20.5,10.36 22.63,8.23 U3.5
N$11  (via drill 0.25)
  Top 0.152: v33.6,13.03 32.77,13.03 U4.21 | v21.57,19.05 21.57,16.92 19.66,15.01 R9.1
  Bottom 0.152: v33.6,13.03 33.22,13.03 30.56,15.7 30.02,15.7 25.6,20.12 22.63,20.12 v21.57,19.05
N$13  (via drill 0.25)
  Top 0.152: v8.08,16.15 8.15,16.23 8.99,16.23 C11.1
  Bottom 0.152: v8.08,16.15 8.08,16.61 9.45,17.98 13.41,17.98 SJ2.2
RESET  (via drill 0.25)
  Top 0.152: R7.1 8.89,17.69 D4.A 8.91,17.68 v9.37,17.22 | v10.57,15.21 8.84,15.09 8.15,14.4 7.92,14.4 U1.P39
  Bottom 0.152: 11.16,15.43 12.19,16.46 13.41,16.46 SJ2.1 | 11.16,15.43 v10.57,15.21 | 11.16,15.43 v9.37,17.22
SWCLK  (via drill 0.25)
  Top 0.152: v5.79,12.37 5.79,14.33 U1.P43
  Bottom 0.152: v5.79,12.37 5.79,20.65 SWD.4
SWDIO
  Top 0.152: SWD.3 9.91,19.43 9.91,15.7 9.68,15.47 8.76,15.47 8.38,15.09 5.56,15.09 5.18,14.71 5.18,13.49 U1.P44
USBD+
  Top 0.152: X4.3 31.75,16.75 31.73,16.73 31.73,16.49 30.98,15.74 U4.3
USBD-  (via drill 0.35)
  Top 0.152: X4.2 32.4,16.65 v32.26,16.51 | v30.73,16.26 U4.4
  Bottom 0.152: v32.26,16.51 32,16.26 v30.73,16.26
VBAT  (via drill 0.35)
  Top 0.254: Q3.3 23.35,9.65 v22.35,9.65 | U3.3 24.57,4.44 | 24.57,4.44 24.57,3.66 R4.1 24.69,3.66 | 24.57,4.44 26.16,5.33 27.05,6.86 27.05,8.76 v26.92,8.89 C5.1 27.75,9.4 28.96,9.4 31.37,6.98 31.37,5.63 J1.2
  Bottom 0.152: 33.88,7.62 JP3.3
  Bottom 0.254: v22.35,9.65 26.16,9.65 v26.92,8.89 | 33.4,7.62 33.88,7.62 | JP3.3 32.38,7.62 31.33,6.56 J1.2
VBUS  (via drill 0.35)
  Top 0.254: X4.1 33.05,16.73 v33.27,16.51 | U3.4 Q3.1 25.47,12.82 D5.A | D5.A 25.74,13.96 U4.8 | R12.2 19.65,20.37 CHG.A 19.85,21.12 v20.57,21.84 20.65,21.79 24.92,21.79 25.45,21.26 25.45,14.33 D5.A
  Bottom 0.254: v33.27,16.51 33.27,21.08 32.51,21.84 v20.57,21.84
VIN
  Top 0.254: D5.C 22.67,13.32 Q3.2 | D5.C 20.25,12.7 C6.1 | D5.C 22.77,15.22 R5.2 22.67,16.36 U2.1
VLED
  Bottom 0.152: JP3.2 33.88,8.64 | 36.7,14.1 LEDCONN.1
  Bottom 0.254: JP3.2 34.29,8.89 | 33.88,8.64 35.31,8.64 35.56,8.89 35.56,9.91 35.81,10.16 35.81,13.21 36.7,14.1

### Text on the board
tPlace: GND | PRGM | CHIPLED_0805 | SWCLK | SWDIO | 3.3V | BMD-300 | XTAL3215 | GND | VBAT
bPlace: VLED | A0 | GND | #banglet 2018 / @nishakmr / Thanks to: / Adafruit Industries / OSHPark